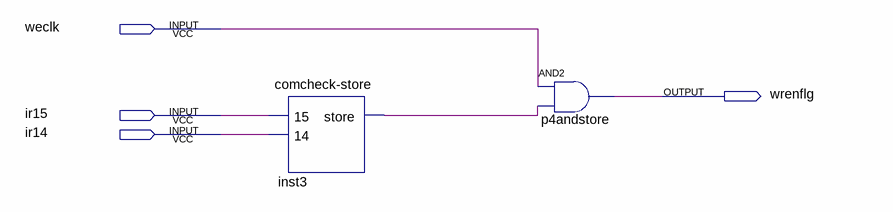
[diagram p0: schematic sheet]
// Quartus schematic wrencheck.bdf as structural Verilog: 2 symbols, 4 pins
module wrencheck (
  input  weclk,
  input  ir15,
  input  ir14,
  output wrenflg
);

  wire inst3_store;

  \comcheck-store  inst3 (.\15 (ir15), .\14 (ir14), .store(inst3_store));
  and p4andstore (wrenflg, weclk, inst3_store);
endmodule
